# Altium project TP-SENSOR-R01.PrjPcb
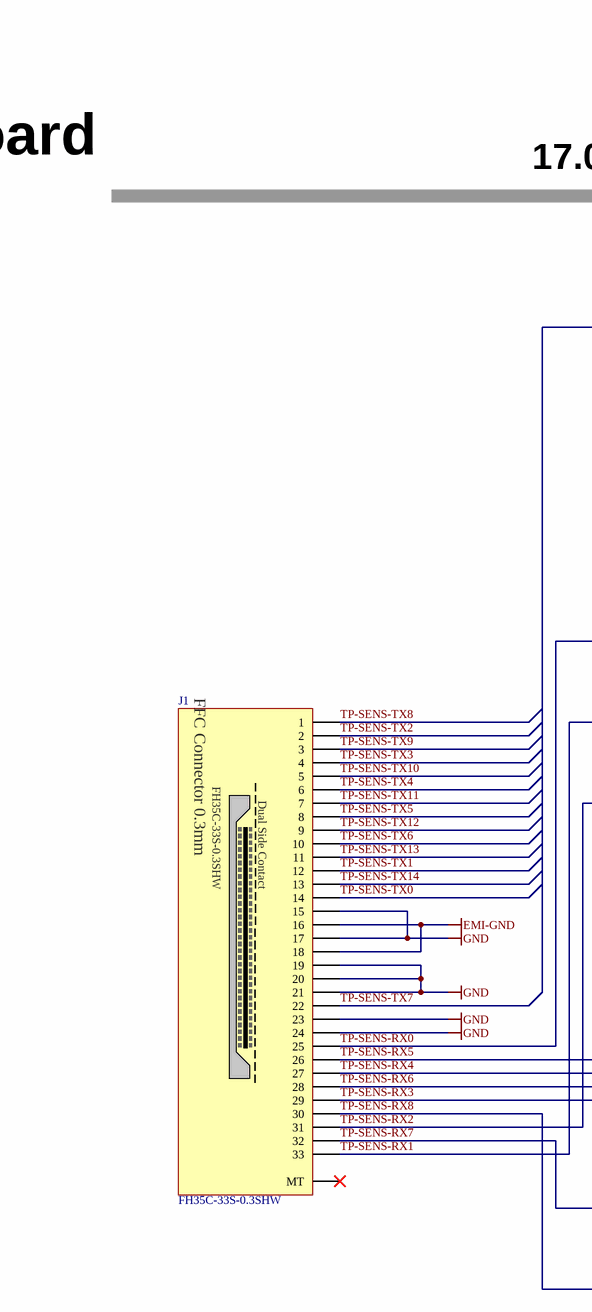
[diagram p0: TP-SENSOR-R01.SchDoc, left]
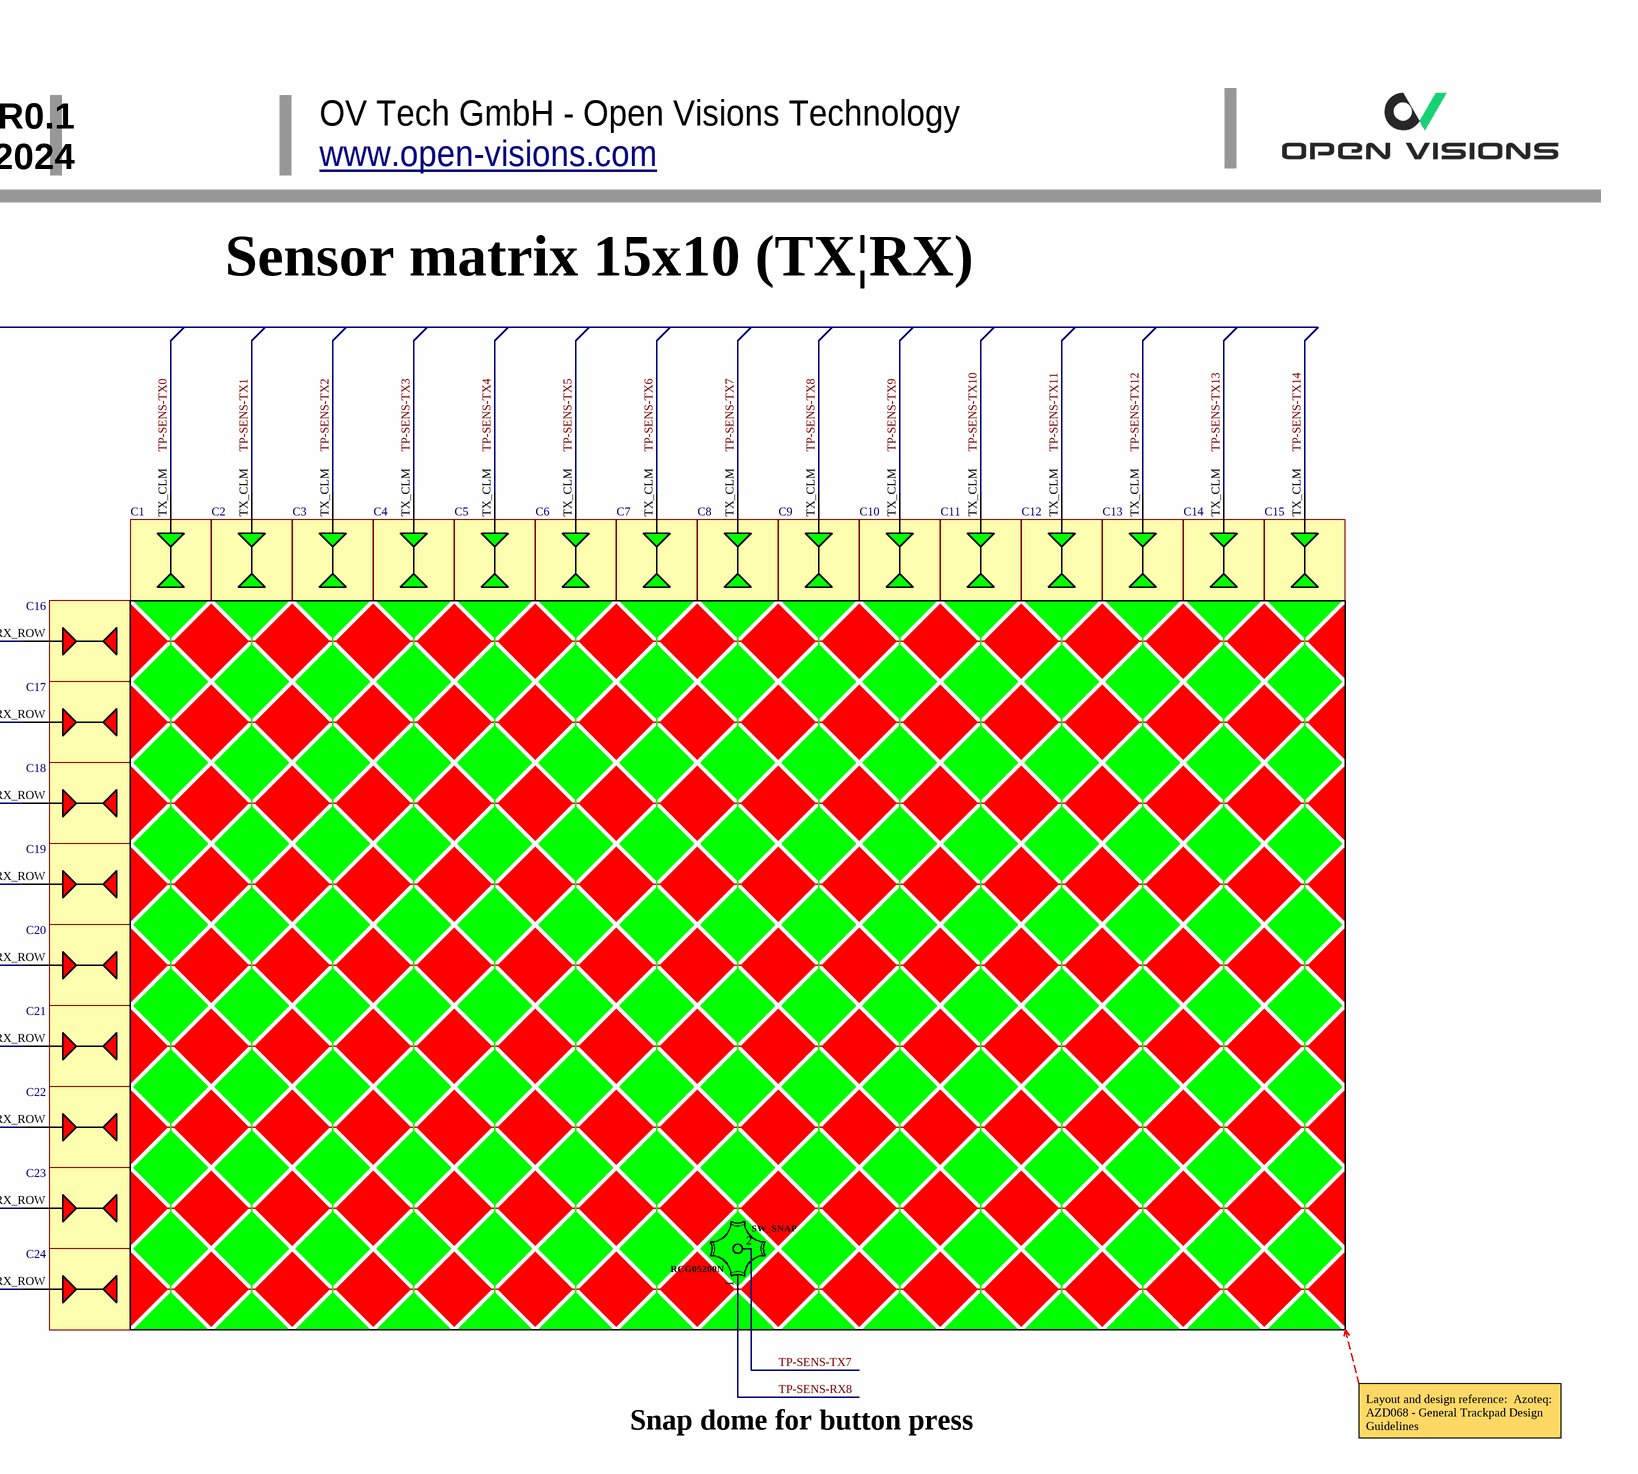
[diagram p1: TP-SENSOR-R01.SchDoc, right]
Revision: Rev0.1; Project: Helios; PCBTitle: Trackpad Sensor PCB 15x10; License: CERN-OHL-S-2.0; Customer: /; ConfidialityLevel: Open-source
1 sheet, 27 parts. Net scope: global (net labels, ports and power ports of the same name join across sheets).
Board file: TP-SENSOR-15x10-CH-R01.PcbDoc

## Sheet TP-SENSOR-R01.SchDoc: Trackpad Sensor PCB 15x10
size 420 x 297 mm; Author: T. Ludemann; SheetNumber: 1; SheetTotal: 1; DocSize: DINA2; Reviewer: L. Henkel; DevStatus: In test

### Parts
?  (no value)  (graphical)
C1  CAP_TRACKPAD_TX_CLM  [CAP_TRACKPAD_TX_CLM]  (value not drawn)  (no BOM)
C2  CAP_TRACKPAD_TX_CLM  [CAP_TRACKPAD_TX_CLM]  (value not drawn)  (no BOM)
C3  CAP_TRACKPAD_TX_CLM  [CAP_TRACKPAD_TX_CLM]  (value not drawn)  (no BOM)
C4  CAP_TRACKPAD_TX_CLM  [CAP_TRACKPAD_TX_CLM]  (value not drawn)  (no BOM)
C5  CAP_TRACKPAD_TX_CLM  [CAP_TRACKPAD_TX_CLM]  (value not drawn)  (no BOM)
C6  CAP_TRACKPAD_TX_CLM  [CAP_TRACKPAD_TX_CLM]  (value not drawn)  (no BOM)
C7  CAP_TRACKPAD_TX_CLM  [CAP_TRACKPAD_TX_CLM]  (value not drawn)  (no BOM)
C8  CAP_TRACKPAD_TX_CLM  [CAP_TRACKPAD_TX_CLM]  (value not drawn)  (no BOM)
C9  CAP_TRACKPAD_TX_CLM  [CAP_TRACKPAD_TX_CLM]  (value not drawn)  (no BOM)
C10  CAP_TRACKPAD_TX_CLM  [CAP_TRACKPAD_TX_CLM]  (value not drawn)  (no BOM)
C11  CAP_TRACKPAD_TX_CLM  [CAP_TRACKPAD_TX_CLM]  (value not drawn)  (no BOM)
C12  CAP_TRACKPAD_TX_CLM  [CAP_TRACKPAD_TX_CLM]  (value not drawn)  (no BOM)
C13  CAP_TRACKPAD_TX_CLM  [CAP_TRACKPAD_TX_CLM]  (value not drawn)  (no BOM)
C14  CAP_TRACKPAD_TX_CLM  [CAP_TRACKPAD_TX_CLM]  (value not drawn)  (no BOM)
C15  CAP_TRACKPAD_TX_CLM  [CAP_TRACKPAD_TX_CLM]  (value not drawn)  (no BOM)
C16  CAP_TRACKPAD_RX_ROW  [CAP_TRACKPAD_RX_ROW]  (value not drawn)  (no BOM)
C17  CAP_TRACKPAD_RX_ROW  [CAP_TRACKPAD_RX_ROW]  (value not drawn)  (no BOM)
C18  CAP_TRACKPAD_RX_ROW  [CAP_TRACKPAD_RX_ROW]  (value not drawn)  (no BOM)
C19  CAP_TRACKPAD_RX_ROW  [CAP_TRACKPAD_RX_ROW]  (value not drawn)  (no BOM)
C20  CAP_TRACKPAD_RX_ROW  [CAP_TRACKPAD_RX_ROW]  (value not drawn)  (no BOM)
C21  CAP_TRACKPAD_RX_ROW  [CAP_TRACKPAD_RX_ROW]  (value not drawn)  (no BOM)
C22  CAP_TRACKPAD_RX_ROW  [CAP_TRACKPAD_RX_ROW]  (value not drawn)  (no BOM)
C23  CAP_TRACKPAD_RX_ROW  [CAP_TRACKPAD_RX_ROW]  (value not drawn)  (no BOM)
C24  CAP_TRACKPAD_RX_ROW  [CAP_TRACKPAD_RX_ROW]  (value not drawn)  (no BOM)
J1  FH35C-33S-0.3SHW  [FFC 33pol 0.3mm FH35C-33S-0.3SHW]
SW_SNAP  RCG05200N  [SNAPDOME_RCG05200N]

### Nets
EMI-GND: J1.16 J1.18
GND: J1.15 J1.17 J1.19 J1.20 J1.21 J1.23 J1.24
TP-SENS-RX0: C16.RX_ROW J1.25
TP-SENS-RX1: C17.RX_ROW J1.33
TP-SENS-RX2: C18.RX_ROW J1.31
TP-SENS-RX3: C19.RX_ROW J1.29
TP-SENS-RX4: C20.RX_ROW J1.27
TP-SENS-RX5: C21.RX_ROW J1.26
TP-SENS-RX6: C22.RX_ROW J1.28
TP-SENS-RX7: C23.RX_ROW J1.32
TP-SENS-RX8: C24.RX_ROW J1.30 SW_SNAP.1
TP-SENS-TX0: C1.TX_CLM J1.14
TP-SENS-TX1: C2.TX_CLM J1.12
TP-SENS-TX2: C3.TX_CLM J1.2
TP-SENS-TX3: C4.TX_CLM J1.4
TP-SENS-TX4: C5.TX_CLM J1.6
TP-SENS-TX5: C6.TX_CLM J1.8
TP-SENS-TX6: C7.TX_CLM J1.10
TP-SENS-TX7: C8.TX_CLM J1.22 SW_SNAP.2
TP-SENS-TX8: C9.TX_CLM J1.1
TP-SENS-TX9: C10.TX_CLM J1.3
TP-SENS-TX10: C11.TX_CLM J1.5
TP-SENS-TX11: C12.TX_CLM J1.7
TP-SENS-TX12: C13.TX_CLM J1.9
TP-SENS-TX13: C14.TX_CLM J1.11
TP-SENS-TX14: C15.TX_CLM J1.13

Not connected (* = marked no-connect by the designer): J1 MT*

### Notes on the sheet
- Trackpad sensor board
- R0.1
- 17.07.2024
- OV Tech GmbH - Open Visions Technology
- www.open-visions.com <http://www.open-visions.com>
- Sensor matrix 15x10 (TX|RX)
- Snap dome for button press
- Layout and design reference:  Azoteq: AZD068 - General Trackpad Design Guidelines
- (in symbol FFC Connector_33pol_FH35C-33S-0.3SHW) FFC Connector 0.3mm; Dual Side Contact

### Library data of the parts
? = Titleblock_01_OpenSource
C1-C15 = CAP_TRACKPAD_TX_CLM: Single trackpad sensor element within a square of 8.5x8.5mm
C16-C24 = CAP_TRACKPAD_RX_ROW: Single trackpad sensor element within a square of 8.5x8.5mm
J1 = FFC Connector_33pol_FH35C-33S-0.3SHW: FFC Connector 33pol 0.3mm Pitch Double Sided Contacts; Manufacturer 1: Hirose Connector; Manufacturer 1 Prt. Nr.: FH35C-33S-0.3SHW(99)
SW_SNAP = SW_SNAPDOME_RCG05200N_5.3mm: RCG-Series Tactile Domes 5.3mm; Manufacturer 1: Snaptron Inc; Manufacturer 1 Prt. Nr.: RCG05200N